# Altium project Brains.PrjPcb
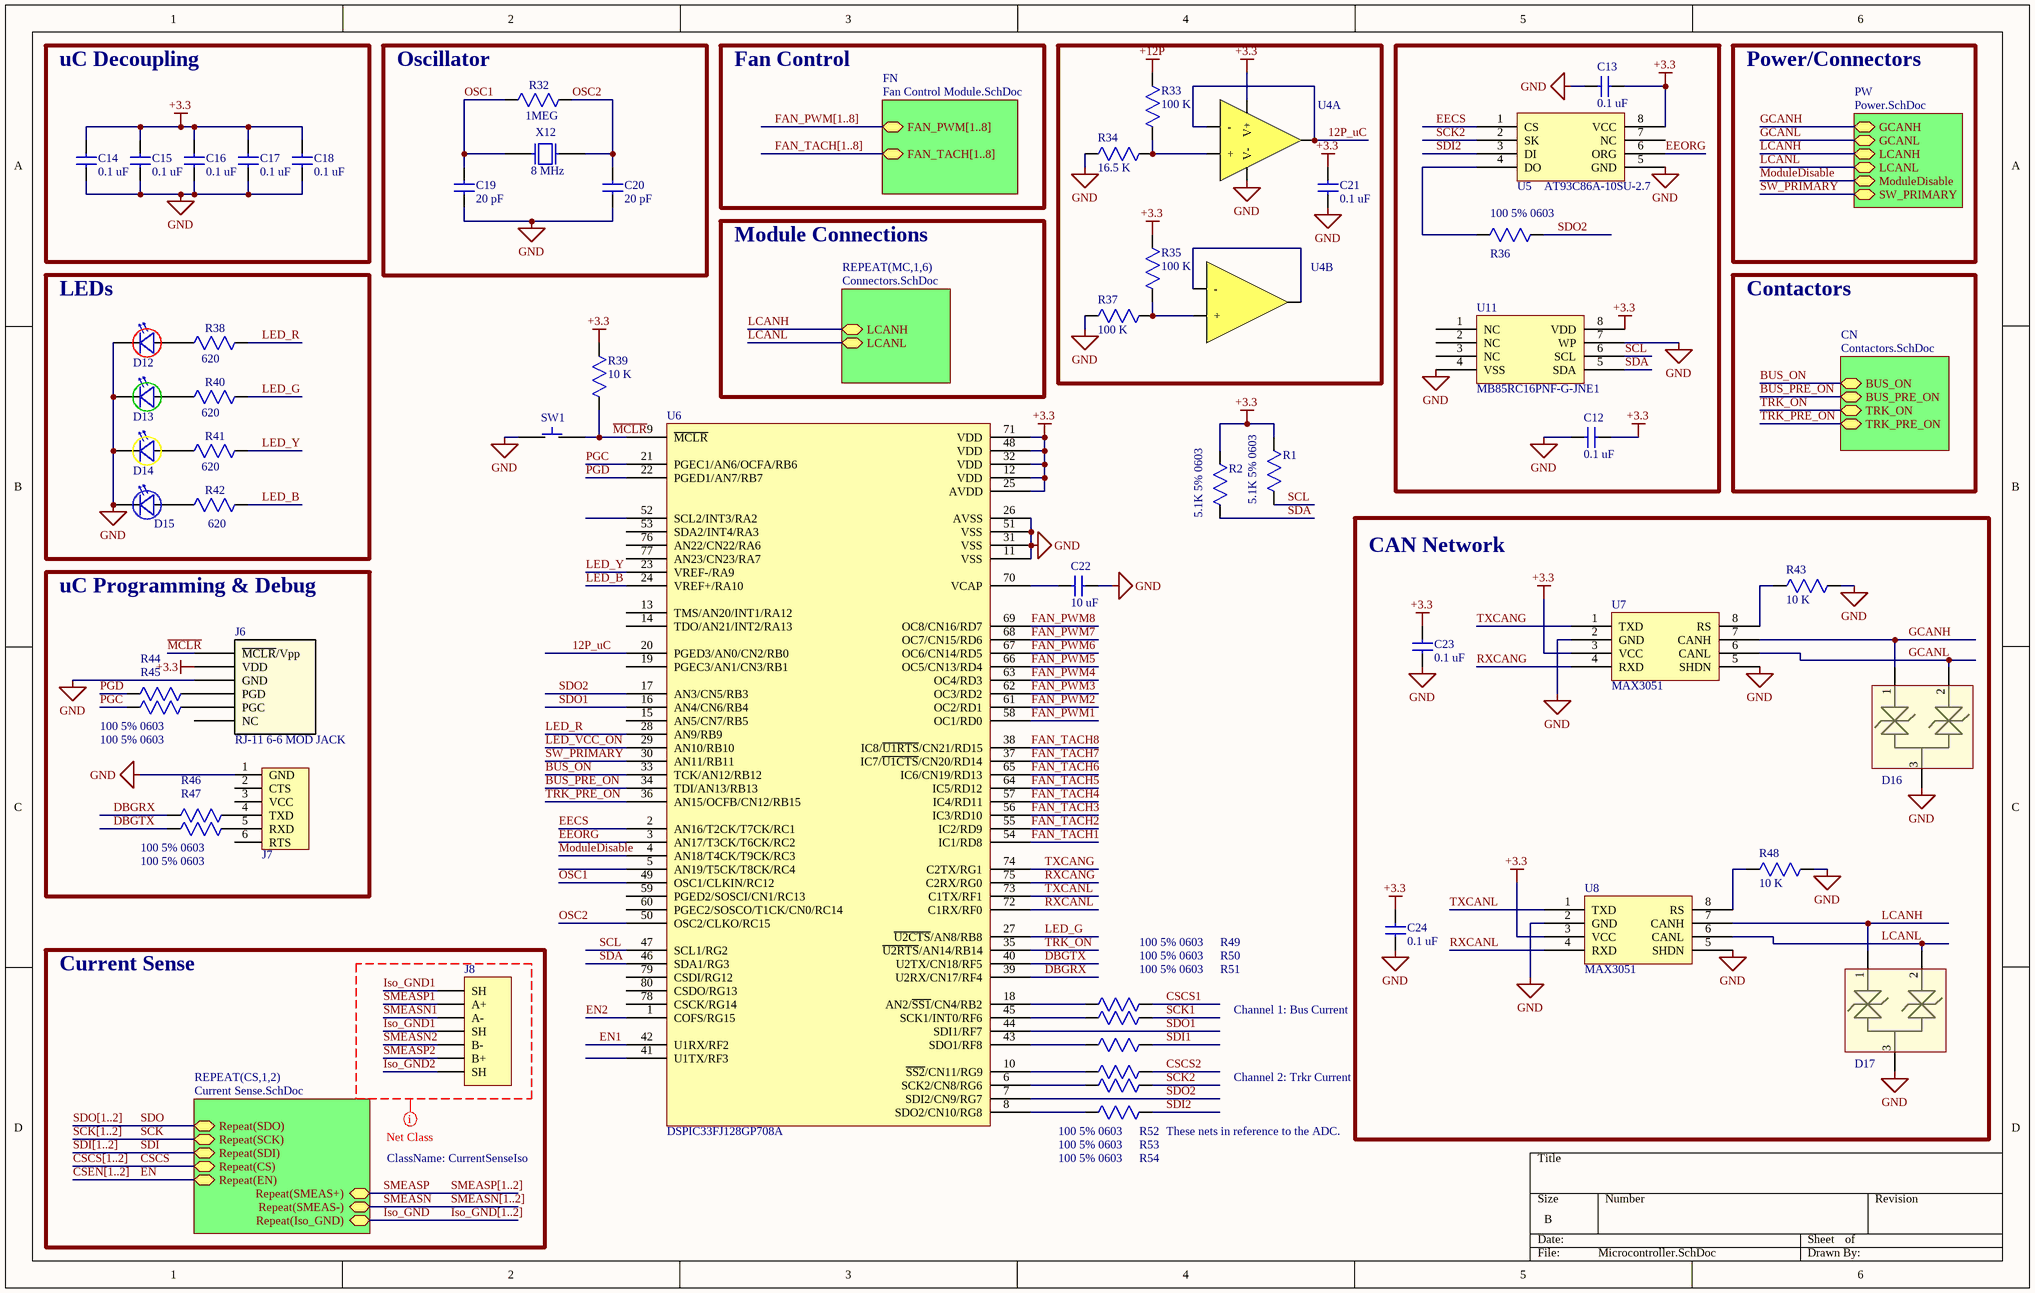
[diagram p0: Microcontroller.SchDoc]
6 sheets, 215 parts. Net scope: hierarchical (ports join the sheet entries above them; power ports are global).
Board file: Brains3.PcbDoc
Sheets:
  Microcontroller.SchDoc
    FN = Fan Control Module.SchDoc
    CS1 = Current Sense.SchDoc
    CS2 = Current Sense.SchDoc
    PW = Power.SchDoc
    CN = Contactors.SchDoc
    MC1 = Connectors.SchDoc
    MC2 = Connectors.SchDoc
    MC3 = Connectors.SchDoc
    MC4 = Connectors.SchDoc
    MC5 = Connectors.SchDoc
    MC6 = Connectors.SchDoc

## Sheet Microcontroller.SchDoc
size B

### Parts
C12  value 0.1 uF  [0603_cap]  (hidden comment: CAP 0603)
C13  value 0.1 uF  [0603_cap]  (hidden comment: CAP 0603)
C14  value 0.1 uF  [0603_cap]  (hidden comment: CAP 0603)
C15  value 0.1 uF  [0603_cap]  (hidden comment: CAP 0603)
C16  value 0.1 uF  [0603_cap]  (hidden comment: CAP 0603)
C17  value 0.1 uF  [0603_cap]  (hidden comment: CAP 0603)
C18  value 0.1 uF  [0603_cap]  (hidden comment: CAP 0603)
C19  value 20 pF  [0805_Capacitor]  (hidden comment: CAP 20PF)
C20  value 20 pF  [0805_Capacitor]  (hidden comment: CAP 20PF)
C21  value 0.1 uF  [0603_cap]  (hidden comment: CAP 0603)
C22  value 10 uF  [0805_Capacitor]  (hidden comment: CAP 10 uF)
C23  value 0.1 uF  [0603_cap]  (hidden comment: CAP 0603)
C24  value 0.1 uF  [0603_cap]  (hidden comment: CAP 0603)
D12  D_LED_0805_RED  [0805P_RED]  (value not drawn)
D13  D_LED_0805_GREEN  [0805P_Green]  (value not drawn)
D14  D_LED_0805_YELLOW  [0805P_YELLOW]  (value not drawn)
D15  D_LED_0805_BLUE  [0805_BLUE]  (value not drawn)
D16  CAN TVS  [SOT-23]  (value not drawn)
D17  CAN TVS  [SOT-23]  (value not drawn)
J6  RJ-11 6-6 MOD JACK  [SS-6466-NF]
J7  IDC Connector  [6PIN_1_.100IN]  (value not drawn)
J8  J_SATA_0471554001  [SATA_67800-8005]  (value not drawn)
R1  value 5.1K 5% 0603  [0603_res]  (hidden comment: RES 0603)
R2  value 5.1K 5% 0603  [0603_res]  (hidden comment: RES 0603)
R32  value 1MEG  [0805_Resistor]  (hidden comment: R_0805_1MEG_1%)
R33  value 100 K  [0603_res]  (hidden comment: RES 0603)
R34  value 16.5 K  [0603_res]  (hidden comment: RES 0603)
R35  value 100 K  [0603_res]  (hidden comment: RES 0603)
R36  value 100 5% 0603  [0603_res]  (hidden comment: RES 0603)
R37  value 100 K  [0603_res]  (hidden comment: RES 0603)
R38  value 620  [0805_Resistor]  (hidden comment: R_0805_620_1%)
R39  value 10 K  [0603_res]  (hidden comment: RES 0603)
R40  value 620  [0805_Resistor]  (hidden comment: R_0805_620_1%)
R41  value 620  [0805_Resistor]  (hidden comment: R_0805_620_1%)
R42  value 620  [0805_Resistor]  (hidden comment: R_0805_620_1%)
R43  value 10 K  [0603_res]  (hidden comment: RES 0603)
R44  value 100 5% 0603  [0603_res]  (hidden comment: RES 0603)
R45  value 100 5% 0603  [0603_res]  (hidden comment: RES 0603)
R46  value 100 5% 0603  [0603_res]  (hidden comment: RES 0603)
R47  value 100 5% 0603  [0603_res]  (hidden comment: RES 0603)
R48  value 10 K  [0603_res]  (hidden comment: RES 0603)
R49  value 100 5% 0603  [0603_res]  (hidden comment: RES 0603)
R50  value 100 5% 0603  [0603_res]  (hidden comment: RES 0603)
R51  value 100 5% 0603  [0603_res]  (hidden comment: RES 0603)
R52  value 100 5% 0603  [0603_res]  (hidden comment: RES 0603)
R53  value 100 5% 0603  [0603_res]  (hidden comment: RES 0603)
R54  value 100 5% 0603  [0603_res]  (hidden comment: RES 0603)
SW1  SW_TACT_SWITCH_6x6  [TACT_SWITCH_6x6]  (value not drawn)
U4  IC OP AMP  [SOIC127P600X175-8N]  (value not drawn)  (parts A,B of 2)
U5  AT93C86A-10SU-2.7  [SOIC127P600X175-8N]
U6  DSPIC33FJ128GP708A  [dspic33-tqfp80]
U7  value MAX3051  [SOIC127P600X175-8N]  (hidden comment: U_MAX3051)
U8  value MAX3051  [SOIC127P600X175-8N]  (hidden comment: U_MAX3051)
U11  Manufacturer PN: MB85RC16PNF-G-JNE1  [SOIC127P600X175-8N]  (hidden comment: U_MB85RC16PNF-G-JNE1)
X12  value 8 MHz  [HC-49]  (hidden comment: HC49)

### Blocks framed on the sheet
uC Decoupling: C14-C18
Oscillator: C19 C20 R32 X12
LEDs: D12-D15 R38 R40-R42
CAN Network: C23 C24 D16 D17 R43 R48 U7 U8
uC Programming & Debug: J6 J7 R44-R47
Current Sense: J8

### Sub-sheets
CN = Contactors.SchDoc: BUS_ON, BUS_PRE_ON, TRK_ON, TRK_PRE_ON
FN = Fan Control Module.SchDoc: FAN_PWM[1..8], FAN_TACH[1..8]
PW = Power.SchDoc: GCANH, GCANL, LCANH, LCANL, ModuleDisable, SW_PRIMARY
REPEAT(CS,1,2) = Current Sense.SchDoc: Repeat(SDO), Repeat(SCK), Repeat(SDI), Repeat(CS), Repeat(SMEAS+), Repeat(SMEAS-), Repeat(EN), Repeat(Iso_GND)
REPEAT(MC,1,6) = Connectors.SchDoc: LCANH, LCANL

### Nets
+3.3: C12.2 C13.2 C14.1 C15.1 C16.1 C17.1 C18.1 C21.1 C23.1 C24.1 J6.2(VDD) R1.1 R2.1 R35.1 R39.1 U4.8(V+) U5.8(VCC) U6.12(VDD) U6.25(AVDD) U6.32(VDD) U6.48(VDD) U6.71(VDD) U7.3(VCC) U8.3(VCC) U11.8(VDD)
+12P: R33.1
GND: C12.1 C13.1 C14.2 C15.2 C16.2 C17.2 C18.2 C19.2 C20.2 C21.2 C22.1 C23.2 C24.2 D12.1(Cathode) D13.1(Cathode) D14.1(Cathode) D15.1(Cathode) D16.3 D17.3 J6.3(GND) J7.1(GND) R34.1 R37.1 R43.1 R48.1 SW1.1 U4.4(V-) U5.5(GND) U6.11(VSS) U6.26(AVSS) U6.31(VSS) U6.51(VSS) U7.2(GND) U7.5(SHDN) U8.2(GND) U8.5(SHDN) U11.4(VSS) U11.7(WP)
12P_uC: U4.1(Vo) U4.2(-) U6.20(PGED3/AN0/CN2/RB0)
BUS_ON: U6.33(TCK/AN12/RB12) ; sheet CN/BUS_ON
BUS_PRE_ON: U6.34(TDI/AN13/RB13) ; sheet CN/BUS_PRE_ON
CSCS: sheet REPEAT(CS,1,2)/Repeat(CS)
CSCS1: R51.1
CSCS2: R54.1
DBGRX: R46.2 U6.39(U2RX/CN17/RF4)
DBGTX: R47.2 U6.40(U2TX/CN18/RF5)
EECS: U5.1(CS) U6.2(AN16/T2CK/T7CK/RC1)
EEORG: U5.6(ORG) U6.3(AN17/T3CK/T6CK/RC2)
EN: sheet REPEAT(CS,1,2)/Repeat(EN)
EN1: U6.42(U1RX/RF2)
EN2: U6.1(COFS/RG15)
FAN_PWM1: U6.58(OC1/RD0)
FAN_PWM2: U6.61(OC2/RD1)
FAN_PWM3: U6.62(OC3/RD2)
FAN_PWM4: U6.63(OC4/RD3)
FAN_PWM5: U6.66(OC5/CN13/RD4)
FAN_PWM6: U6.67(OC6/CN14/RD5)
FAN_PWM7: U6.68(OC7/CN15/RD6)
FAN_PWM8: U6.69(OC8/CN16/RD7)
FAN_TACH1: U6.54(IC1/RD8)
FAN_TACH2: U6.55(IC2/RD9)
FAN_TACH3: U6.56(IC3/RD10)
FAN_TACH4: U6.57(IC4/RD11)
FAN_TACH5: U6.64(IC5/RD12)
FAN_TACH6: U6.65(IC6/CN19/RD13)
FAN_TACH7: U6.37(IC7/~{U1CTS}/CN20/RD14)
FAN_TACH8: U6.38(IC8/~{U1RTS}/CN21/RD15)
GCANH: D16.1 U7.7(CANH) ; sheet PW/GCANH
GCANL: D16.2 U7.6(CANL) ; sheet PW/GCANL
Iso_GND: sheet REPEAT(CS,1,2)/Repeat(Iso_GND)
Iso_GND1: J8.1(SH) J8.4(SH)  [project net Iso_GND]
Iso_GND2: J8.7(SH)  [project net Iso_GND]
LCANH: D17.1 U8.7(CANH) ; sheet PW/LCANH, sheet REPEAT(MC,1,6)/LCANH
LCANL: D17.2 U8.6(CANL) ; sheet PW/LCANL, sheet REPEAT(MC,1,6)/LCANL
LED_B: R42.1 U6.24(VREF+/RA10)
LED_G: R40.1 U6.27(~{U2CTS}/AN8/RB8)
LED_R: R38.1 U6.28(AN9/RB9)
LED_VCC_ON: U6.29(AN10/RB10)
LED_Y: R41.1 U6.23(VREF-/RA9)
~{MCLR}: J6.1(~{MCLR}/Vpp) R39.2 SW1.2 U6.9(~{MCLR})
ModuleDisable: U6.4(AN18/T4CK/T9CK/RC3) ; sheet PW/ModuleDisable
OSC1: C19.1 R32.2 U6.49(OSC1/CLKIN/RC12) X12.2
OSC2: C20.1 R32.1 U6.50(OSC2/CLKO/RC15) X12.1
PGC: R45.2 U6.21(PGEC1/AN6/OCFA/RB6)
PGD: R44.2 U6.22(PGED1/AN7/RB7)
RXCANG: U6.75(C2RX/RG0) U7.4(RXD)
RXCANL: U6.72(C1RX/RF0) U8.4(RXD)
SCK: sheet REPEAT(CS,1,2)/Repeat(SCK)
SCK1: R50.1
SCK2: R53.1 U5.2(SK)
SCL: R1.2 U6.47(SCL1/RG2) U11.6(SCL)
SDA: R2.2 U6.46(SDA1/RG3) U11.5(SDA)
SDI: sheet REPEAT(CS,1,2)/Repeat(SDI)
SDI1: R49.1
SDI2: R52.1 U5.3(DI)
SDO: sheet REPEAT(CS,1,2)/Repeat(SDO)
SDO1: U6.16(AN4/CN6/RB4) U6.44(SDI1/RF7)
SDO2: R36.1 U6.7(SDI2/CN9/RG7) U6.17(AN3/CN5/RB3)
SMEASN: sheet REPEAT(CS,1,2)/Repeat(SMEAS-)
SMEASN1: J8.3(A-)
SMEASN2: J8.5(B-)
SMEASP: sheet REPEAT(CS,1,2)/Repeat(SMEAS+)
SMEASP1: J8.2(A+)
SMEASP2: J8.6(B+)
SW_PRIMARY: U6.30(AN11/RB11) ; sheet PW/SW_PRIMARY
TRK_ON: U6.35(~{U2RTS}/AN14/RB14) ; sheet CN/TRK_ON
TRK_PRE_ON: U6.36(AN15/OCFB/CN12/RB15) ; sheet CN/TRK_PRE_ON
TXCANG: U6.74(C2TX/RG1) U7.1(TXD)
TXCANL: U6.73(C1TX/RF1) U8.1(TXD)
NetC22_2: C22.2 U6.70(VCAP)
NetD12_2: D12.2(Anode) R38.2
NetD13_2: D13.2(Anode) R40.2
NetD14_2: D14.2(Anode) R41.2
NetD15_2: D15.2(Anode) R42.2
NetJ6_4: J6.4(PGD) R44.1
NetJ6_5: J6.5(PGC) R45.1
NetJ7_4: J7.4(TXD) R46.1
NetJ7_5: J7.5(RXD) R47.1
NetR33_2: R33.2 R34.2 U4.3(+)
NetR35_2: R35.2 R37.2 U4.5(+)
NetR36_2: R36.2 U5.4(DO)
NetR43_2: R43.2 U7.8(RS)
NetR48_2: R48.2 U8.8(RS)
NetR49_2: R49.2 U6.43(SDO1/RF8)
NetR50_2: R50.2 U6.45(SCK1/INT0/RF6)
NetR51_2: R51.2 U6.18(AN2/~{SS1}/CN4/RB2)
NetR52_2: R52.2 U6.8(SDO2/CN10/RG8)
NetR53_2: R53.2 U6.6(SCK2/CN8/RG6)
NetR54_2: R54.2 U6.10(~{SS2}/CN11/RG9)
NetU4_6: U4.6(-) U4.7(Vo)

Not connected (* = marked no-connect by the designer): J6 6(NC); J7 2(CTS) 3(VCC) 6(RTS); U5 7(NC); U6 5(AN19/T5CK/T8CK/RC4) 13(TMS/AN20/INT1/RA12) 14(TDO/AN21/INT2/RA13) 15(AN5/CN7/RB5) 19(PGEC3/AN1/CN3/RB1) 41(U1TX/RF3) 52(SCL2/INT3/RA2) 53(SDA2/INT4/RA3) 59(PGED2/SOSCI/CN1/RC13) 60(PGEC2/SOSCO/T1CK/CN0/RC14) 76(AN22/CN22/RA6) 77(AN23/CN23/RA7) 78(CSCK/RG14) 79(CSDI/RG12) 80(CSDO/RG13); U11 1(NC) 2(NC) 3(NC)

### Buses and harness runs
bus CSCS[1..2]
bus CSEN[1..2]
bus FAN_PWM[1..8] = sheet FN/FAN_PWM[1..8]
bus FAN_TACH[1..8] = sheet FN/FAN_TACH[1..8]
bus Iso_GND[1..2]
bus SCK[1..2]
bus SDI[1..2]
bus SDO[1..2]
bus SMEASN[1..2]
bus SMEASP[1..2]

### Layout directives
net class CurrentSenseIso: Iso_GND1, Iso_GND2, SMEASN1, SMEASN2, SMEASP1, SMEASP2

### Notes on the sheet
- Fan Control
- Power/Connectors
- Module Connections
- Contactors
- Channel 1: Bus Current
- Channel 2: Trkr Current
- These nets in reference to the ADC.

### Library data of the parts
C12-C18 C21 C23 C24 = C_0603: CAP CERM 0603; Known Distributors: Digikey; Package: 0603
C19 C20 = C_0805_20PF_100V_5%: CAP CERM 20PF 5% 100V NP0 0805; Manufacturer: AVX; Manufacturer PN: 08051A200JAT2A; SVP Creator: Jonathan Nutzmann; Package: 0805; Known Distributors: Digikey; ComponentLink1Description: Datasheet; ComponentLink1URL: SVN Datasheet URL; Price: 0.231
C22 = C_0805_10uF: CAP CERM 10 uF; Package: 0805; Known Distributors: Digikey; ComponentLink1Description: Datasheet; ComponentLink1URL: SVN Datasheet URL
D12 = D_LED_0805_RED: LED CHIPLED 645NM RED DIFF 0805; SVP Creator: Jonathan Nutzmann; Current: 20mA; Forward Voltage: 1.8; Package: 0805; Known Distributors: Digikey; Value: RED; ComponentLink1Description: Datasheet
D13 = D_LED_0805_GREEN: LED CHIPLED 570NM GREEN 0805 SMD; Manufacturer: Osram Opto Semiconductors Inc; Manufacturer PN: LG R971-KN-1-0-20-R18; SVP Creator: Nate Bolyard; SVP Reviewer 1: Trevtron; Current: 20mA; Forward Voltage: 2.2V; Package: 0805; Known Distributors: Digikey; Value: GREEN; HelpURL: http://umnsvp.dyndns.org/svn/centaurus2/datasheets/common parts/LG_R971.pdf; ComponentLink1URL: http://umnsvp.dyndns.org/svn/centaurus2/datasheets/common parts/LG_R971.pdf; ComponentLink1Description: Datasheet
D14 = D_LED_0805_YELLOW: LED 595NM AMBER DIFF SMD 0805; SVP Creator: Jonathan Nutzmann; Current: 20mA; Forward Voltage: 1.9; Value: YELLOW; Package: 0805; Known Distributors: Digikey; ComponentLink1Description: Datasheet
D15 = D_LED_0805_BLUE: LED 2X1.2MM 470NM BL WTR CLR SMD; SVP Creator: Jonathan Nutzmann; Current: 20mA; Forward Voltage: 3.3; Value: RED; Package: 0805; Known Distributors: Digikey; ComponentLink1Description: Datasheet
D16 D17 = D_NUP2105: IC CAN BUS PROTECTOR DUAL SOT23; Manufacturer: ON Semiconductor; SVP Creator: Thomas Daede; Package: SOT-23; Manufacturer PN: NUP2105; ComponentLink1Description: Datasheet; ComponentLink1URL: SVN Datasheet URL; Price: 0.50
J6 = J_ICD PROG: SCS RJ-11 Jack
J7 = JP_FTDI_USB: FTDI Cable VCC I/O; SVP Creator: Jonathan Nutzmann
J8 = J_SATA_0471554001: CONN SATA HDR 7POS PCB VERT; Manufacturer: Molex; Known Distributors: Digikey; Manufacturer PN: 0471554001
R1 R2 R33-R37 R39 R43-R54 = R_0603: Known Distributors: Digikey; Package: 0603
R32 = R_0805_1MEG_1%: RES 1MEG OHM 1/8W 1% 0805 SMD; Power Rating: .125W; SVP Creator: Brett Paulsen; Package: 0805; Known Distributor: Digikey; ComponentLink1Description: Datasheet
R38 R40-R42 = R_0805_620_1%: RES 620 OHM 1/8W 1% 0805 SMD; Power Rating: .125W; SVP Creator: Jonathan Nutzmann; Package: 0805; Known Distributor: Digikey; ComponentLink1Description: Datasheet
SW1 = SW_TACT_SWITCH_6x6: SWITCH TACT 6MM BLACK 160GF; Manufacturer: Tyco Electronics; Manufacturer PN: FSM4JH; SVP Creator: Nate Bolyard; Known Distributors: Digikey; Package: 6mm x 6mm
U4 = U_MCP6042T-I/SN: IC OPAMP 1UA 1.4V DUAL R-R 8SOIC; Manufacturer: Microchip; SVP Creator: Jonathan Nutzmann; Package: 8-SOIC; Known Distributors: Digikey; Manufacturer PN: MCP6042T-I/SN; ComponentLink1Description: Datasheet; ComponentLink1URL: SVN Datasheet URL; Price: 0.97
U5 = U_AT93C86A-10SU-2.7: IC EEPROM 16KBIT 2MHZ 8SOIC; Manufacturer: Atmel; Package: SOIC-8; Manufacturer PN: AT93C86A-10SU-2.7
U6 = U_DSPIC33FJ128GP708A: IC DSPIC MCU/DSP 128K 80-TQFP; Manufacturer: Microchip; SVP Creator: Jonathan Nutzmann; Package: 80-TQFP; Known Distributors: Digikey; ComponentLink1Description: Datasheet; ComponentLink1URL: SVN Datasheet URL; Manufacturer PN: DSPIC33FJ128GP708A
U7 U8 = U_MAX3051: IC TXRX CAN 1MBPS 8-SOIC 3.3V; Manufacturer: Maxim; Manufacturer PN: MAX3051ESA+; SVP Creator: Jonathan Nutzmann; Package: SOIC-8; Known Distributors: DigiKey; ComponentLink1Description: Datasheet
U11 = U_MB85RC16PNF-G-JNE1: IC FRAM 16KBIT 1MHZ 8SOP; Manufacturer: Fujitsu Semiconductor America Inc; Package: SOIC-8; Known Distributors: DigiKey; ComponentLink1Description: Datasheet
X12 = X_HC49: CRYSTAL 8.00 MHZ 20PF 49US; Manufacturer: ECS; Manufacturer PN: ECS-80-20-4X; SVP Creator: Jonathan Nutzmann; Load Capacitance: 20pF; Known Distributor: Digikey; Package: HC49/US; ComponentLink1Description: Datasheet

## Sheet Fan Control Module.SchDoc
size A
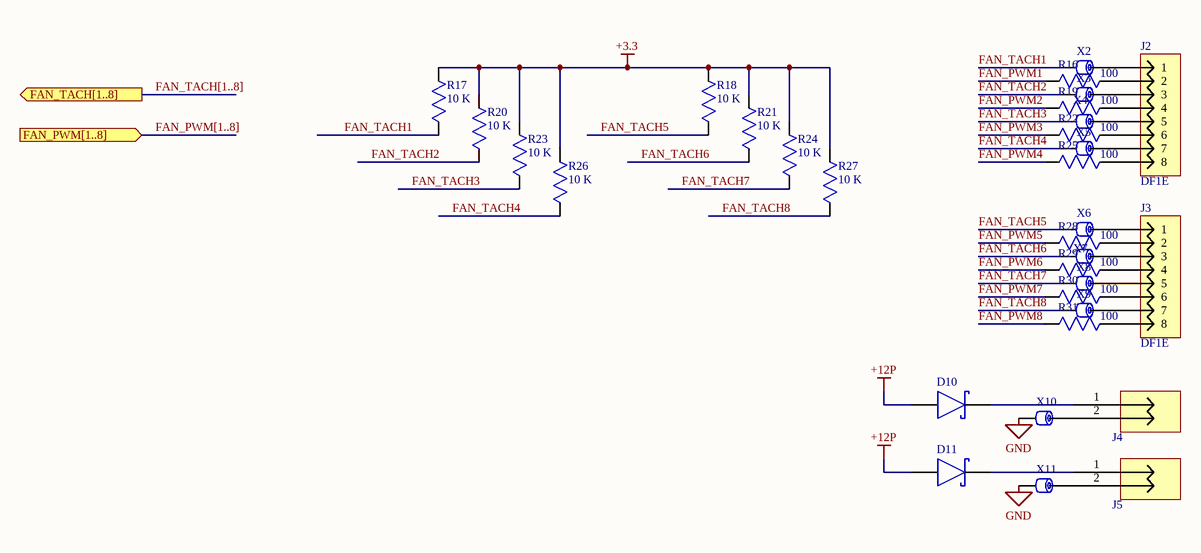
[diagram p1: Fan Control Module.SchDoc]

### Parts
D10  STPS20L15G-TR  [D2PAK-D]  (value not drawn)
D11  STPS20L15G-TR  [D2PAK-D]  (value not drawn)
J2  value DF1E  [DF1EC-8P-2.5DSA]  (hidden comment: DF1E 5-pin Male Header)
J3  value DF1E  [DF1EC-8P-2.5DSA]  (hidden comment: DF1E 5-pin Male Header)
J4  J_PHOENIX_2M_5.08  [PHX2UP]  (value not drawn)
J5  J_PHOENIX_2M_5.08  [PHX2UP]  (value not drawn)
R16  value 100  [0603_res]  (hidden comment: RES 0603)
R17  value 10 K  [0603_res]  (hidden comment: RES 0603)
R18  value 10 K  [0603_res]  (hidden comment: RES 0603)
R19  value 100  [0603_res]  (hidden comment: RES 0603)
R20  value 10 K  [0603_res]  (hidden comment: RES 0603)
R21  value 10 K  [0603_res]  (hidden comment: RES 0603)
R22  value 100  [0603_res]  (hidden comment: RES 0603)
R23  value 10 K  [0603_res]  (hidden comment: RES 0603)
R24  value 10 K  [0603_res]  (hidden comment: RES 0603)
R25  value 100  [0603_res]  (hidden comment: RES 0603)
R26  value 10 K  [0603_res]  (hidden comment: RES 0603)
R27  value 10 K  [0603_res]  (hidden comment: RES 0603)
R28  value 100  [0603_res]  (hidden comment: RES 0603)
R29  value 100  [0603_res]  (hidden comment: RES 0603)
R30  value 100  [0603_res]  (hidden comment: RES 0603)
R31  value 100  [0603_res]  (hidden comment: RES 0603)
X2  0603  [0603_res]  (value not drawn)
X3  0603  [0603_res]  (value not drawn)
X4  0603  [0603_res]  (value not drawn)
X5  0603  [0603_res]  (value not drawn)
X6  0603  [0603_res]  (value not drawn)
X7  0603  [0603_res]  (value not drawn)
X8  0603  [0603_res]  (value not drawn)
X9  0603  [0603_res]  (value not drawn)
X10  Ferrite Bead  [28F0181-1SR-10]  (value not drawn)
X11  Ferrite Bead  [28F0181-1SR-10]  (value not drawn)

### Ports
FAN_PWM[1..8] (in), FAN_TACH[1..8] (out)

### Nets
+3.3: R17.1 R18.1 R20.1 R21.1 R23.1 R24.1 R26.1 R27.1
+12P: D10.A D11.A
GND: X10.1 X11.1
FAN_PWM1: R16.2
FAN_PWM2: R19.2
FAN_PWM3: R22.2
FAN_PWM4: R25.2
FAN_PWM5: R28.2
FAN_PWM6: R29.2
FAN_PWM7: R30.2
FAN_PWM8: R31.2
FAN_TACH1: R17.2 X2.1
FAN_TACH2: R20.2 X3.1
FAN_TACH3: R23.2 X4.1
FAN_TACH4: R26.2 X5.1
FAN_TACH5: R18.2 X6.1
FAN_TACH6: R21.2 X7.1
FAN_TACH7: R24.2 X8.1
FAN_TACH8: R27.2 X9.1
NetD10_K: D10.K J4.1
NetD11_K: D11.K J5.1
NetJ2_1: J2.1 X2.2
NetJ2_2: J2.2 R16.1
NetJ2_3: J2.3 X3.2
NetJ2_4: J2.4 R19.1
NetJ2_5: J2.5 X4.2
NetJ2_6: J2.6 R22.1
NetJ2_7: J2.7 X5.2
NetJ2_8: J2.8 R25.1
NetJ3_1: J3.1 X6.2
NetJ3_2: J3.2 R28.1
NetJ3_3: J3.3 X7.2
NetJ3_4: J3.4 R29.1
NetJ3_5: J3.5 X8.2
NetJ3_6: J3.6 R30.1
NetJ3_7: J3.7 X9.2
NetJ3_8: J3.8 R31.1
NetJ4_2: J4.2 X10.2
NetJ5_2: J5.2 X11.2

### Buses and harness runs
bus FAN_PWM[1..8] = port FAN_PWM[1..8]
bus FAN_TACH[1..8] = port FAN_TACH[1..8]

### Library data of the parts
D10 D11 = D_Schottky_20A_15V_D2PAK: DIODE SCHOTTKY 20A 15V D2PAK; Manufacturer: STMicro; SVP Creator: Jonathan Nutzmann; Known Distributors: Digi-Key; Manufacturer PN: STPS20L15G-TR; Price: 3.49; ComponentLink1Description: Datasheet
J2 J3 = DF1E_8_S: 9-pin Hirose; Manufacturer: Hirose Electric Co Ltd; Manufacturer PN: DF1EC-8P-2.5DSA(05); SVP Creator: Adam Shea; Package: DF1EC-8; Known Distributors: Digikey; HelpURL: http://umnsvp.dyndns.org/svn/centaurus2/datasheets/common%20parts/DF1E.pdf; ComponentLink1URL: http://umnsvp.dyndns.org/svn/centaurus2/datasheets/common%20parts/DF1E.pdf; ComponentLink1Description: Datasheet
J4 J5 = J_PHOENIX_2M_5.08: 2 Pin From Motor
R16-R31 = R_0603: Known Distributors: Digikey; Package: 0603
X2-X9 = X_0603_FERRITE: FERRITE 0603; Known Distributors: Digikey; Package: 0603
X10 X11 = X_FERRITE_10A_3318: FERRITE 10A 115 OHMS SMD; Manufacturer: Laird-Signal Integrity Products; Package: 3318; Known Distributors: Digikey; Manufacturer PN: 28F0181-1SR-10; Current Rating: 10A

## Sheet Current Sense.SchDoc
size B
Used 2 times, as channels CS1, CS2. Parts and nets are listed once, with the designators drawn on the sheet.
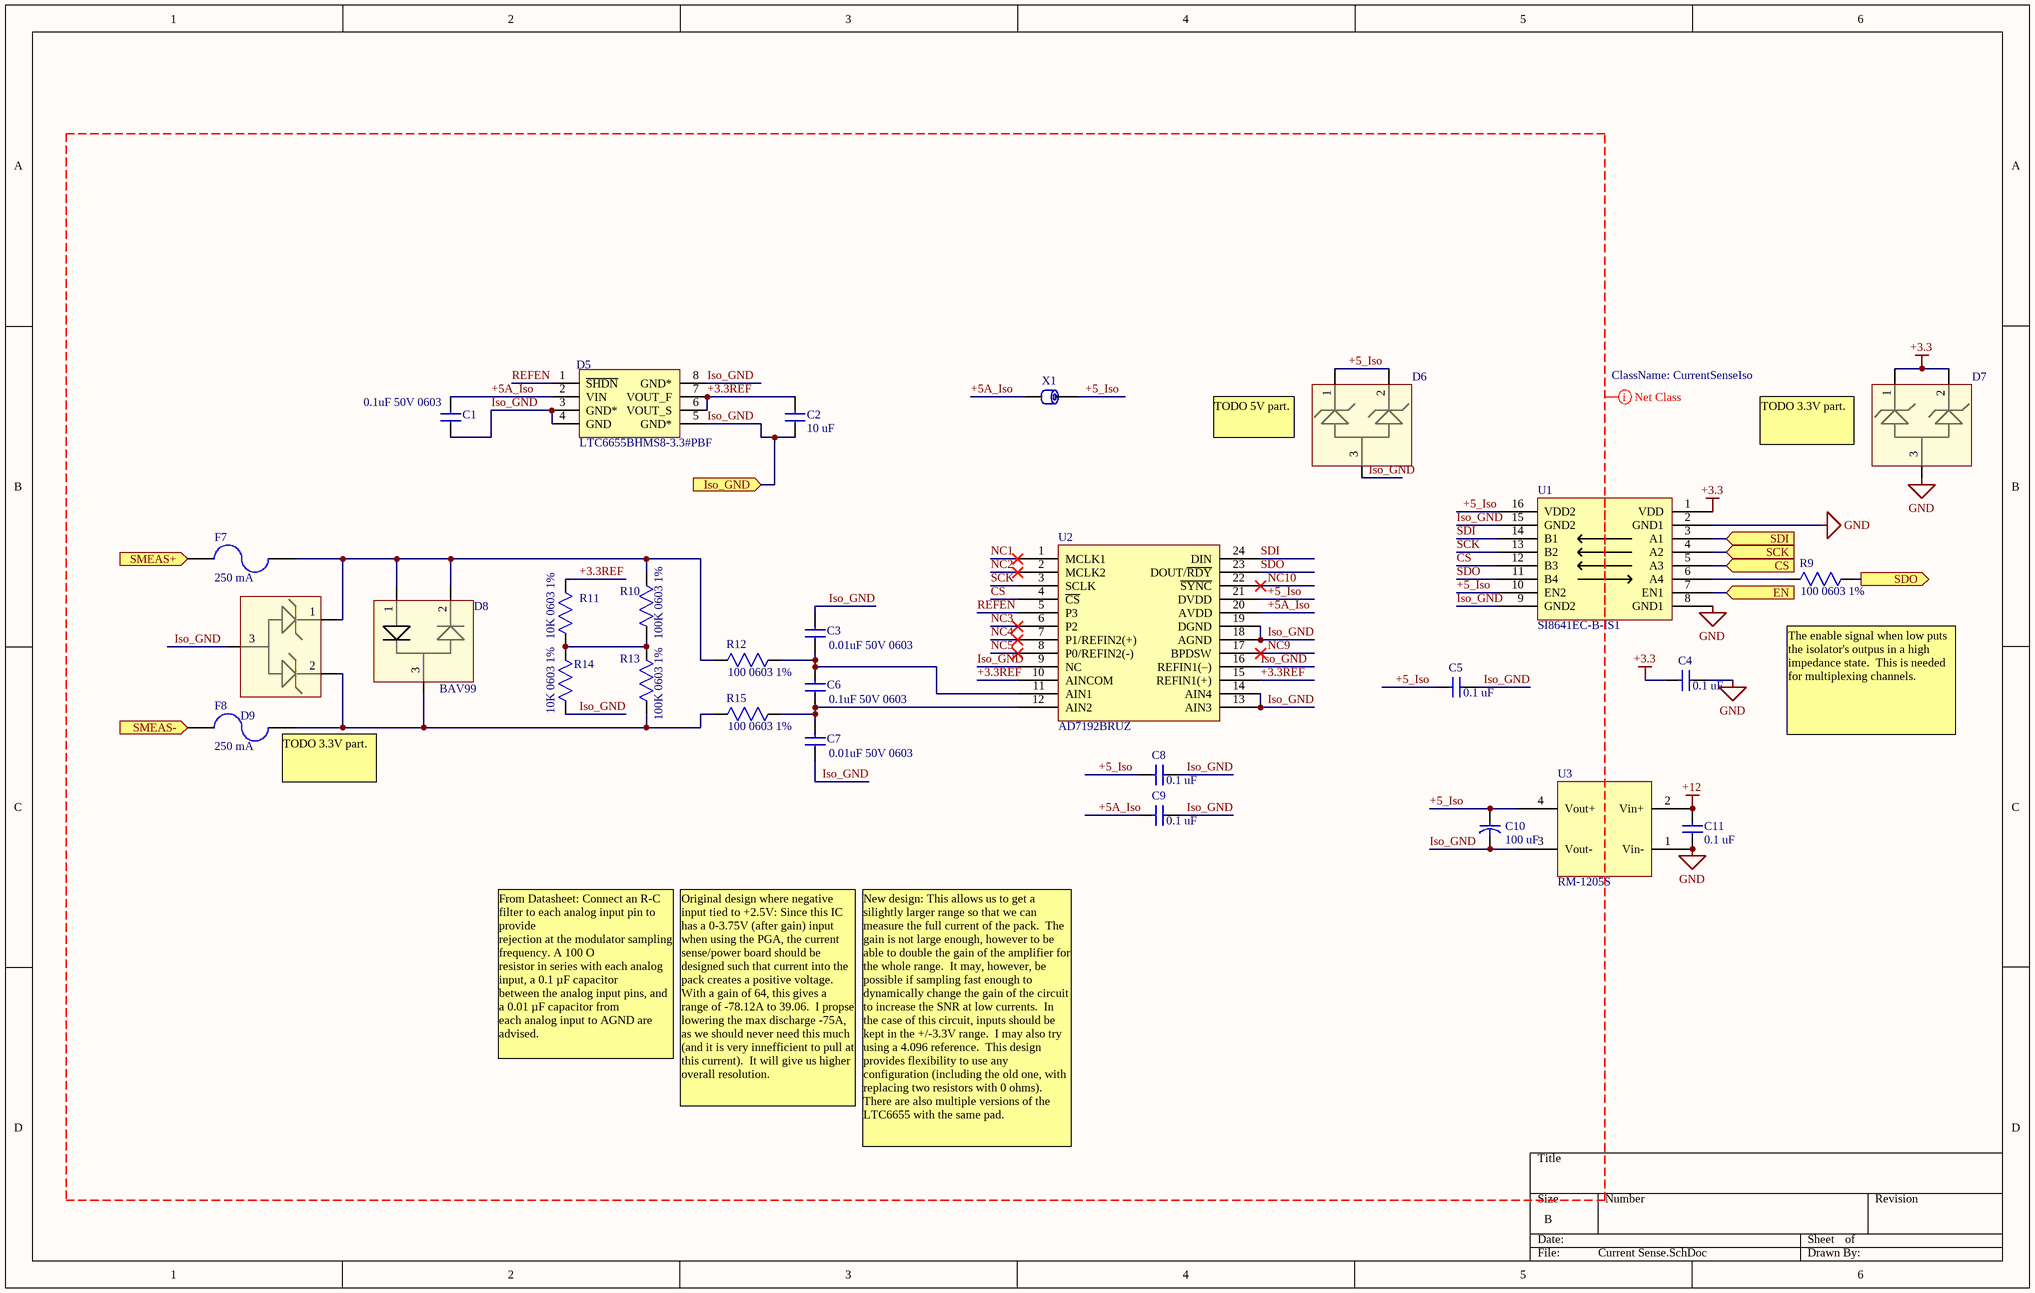
[diagram p2: Current Sense.SchDoc]

### Parts
C1  value 0.1uF 50V 0603  [0603_cap]  (hidden comment: CAP 0603)
C2  value 10 uF  [0805_Capacitor]  (hidden comment: CAP 10 uF)
C3  value 0.01uF 50V 0603  [0603_cap]  (hidden comment: CAP 0603)
C4  value 0.1 uF  [0603_cap]  (hidden comment: CAP 0603)
C5  value 0.1 uF  [0603_cap]  (hidden comment: CAP 0603)
C6  value 0.1uF 50V 0603  [0603_cap]  (hidden comment: CAP 0603)
C7  value 0.01uF 50V 0603  [0603_cap]  (hidden comment: CAP 0603)
C8  value 0.1 uF  [0603_cap]  (hidden comment: CAP 0603)
C9  value 0.1 uF  [0603_cap]  (hidden comment: CAP 0603)
C10  value 100 uF  [EEE-FP1V101AP]  (hidden comment: EEE-FP1V101AP)
C11  value 0.1 uF  [0603_cap]  (hidden comment: CAP 0603)
D5  Manufacturer PN: LTC6655BHMS8-3.3#PBF  [TSOP65P490X110-8N]  (hidden comment: D_LTC6655BHMS8-3.3#PBF)
D6  MMBZ6V8AL,215  [SOT-23]  (value not drawn)
D7  MMBZ6V8AL,215  [SOT-23]  (value not drawn)
D8  BAV99  [SOT-23]
D9  MMBZ6V8AL,215  [SOT-23]  (value not drawn)
F7  250 mA  [1206_RESISTOR]
F8  250 mA  [1206_RESISTOR]
R9  value 100 0603 1%  [0603_res]  (hidden comment: RES 0603)
R10  value 100K 0603 1%  [0603_res]  (hidden comment: RES 0603)
R11  value 10K 0603 1%  [0603_res]  (hidden comment: RES 0603)
R12  value 100 0603 1%  [0603_res]  (hidden comment: RES 0603)
R13  value 100K 0603 1%  [0603_res]  (hidden comment: RES 0603)
R14  value 10K 0603 1%  [0603_res]  (hidden comment: RES 0603)
R15  value 100 0603 1%  [0603_res]  (hidden comment: RES 0603)
U1  Manufacturer PN: SI8641EC-B-IS1  [SOIC16_SI8641]  (hidden comment: U_SI6841EC-B)
U2  Manufacturer PN: AD7192BRUZ  [TSOP65P640X120-24N]  (hidden comment: U_AD7192)
U3  Manufacturer PN: RM-1205S  [SIP4]  (hidden comment: U_RM-1205S)
X1  Ferrite Bead  [0603_res]  (value not drawn)

### Ports
CS, EN, Iso_GND, SCK, SDI, SDO, SMEAS+, SMEAS-

### Nets
+3.3: C4.2 D7.1 D7.2 U1.1(VDD)
+12: C11.1 U3.2(Vin+)
GND: C4.1 C11.2 D7.3 U1.2(GND1) U1.8(GND1) U3.1(Vin-)
+3.3REF: C2.1 D5.6(VOUT_S) D5.7(VOUT_F) R11.2 U2.10(AINCOM) U2.15(REFIN1(+))
+5_Iso: C5.2 C8.2 C10.1 D6.1 D6.2 U1.10(EN2) U1.16(VDD2) U2.21(DVDD) U3.4(Vout+) X1.2
+5A_Iso: C1.1 C9.2 D5.2(VIN) U2.20(AVDD) X1.1
CS: U1.5(A3) ; port CS
CS: U1.12(B3) U2.4(~{CS})  [a separate net that carries the same name]
EN: U1.7(EN1) ; port EN
Iso_GND: C1.2 C2.2 C3.1 C5.1 C7.2 C8.1 C9.1 C10.2 D5.3(GND*) D5.4(GND) D5.5(GND*) D5.8(GND*) D6.3 D9.3 R14.1 U1.9(GND2) U1.15(GND2) U2.9(NC) U2.13(AIN3) U2.14(AIN4) U2.16(REFIN1(–)) U2.18(AGND) U2.19(DGND) U3.3(Vout-) ; port Iso_GND
NC1: U2.1(MCLK1)
NC2: U2.2(MCLK2)
NC3: U2.6(P2)
NC4: U2.7(P1/REFIN2(+))
NC5: U2.8(P0/REFIN2(-))
NC9: U2.17(BPDSW)
NC10: U2.22(~{SYNC})
REFEN: D5.1(~{SHDN}) U2.5(P3)
SCK: U1.4(A2) ; port SCK
SCK: U1.13(B2) U2.3(SCLK)  [a separate net that carries the same name]
SDI: U1.3(A1) ; port SDI
SDI: U1.14(B1) U2.24(DIN)  [a separate net that carries the same name]
SDO: U1.11(B4) U2.23(DOUT/~{RDY})
SDO: R9.1 ; port SDO  [a separate net that carries the same name]
SMEAS+: F7.1 ; port SMEAS+
SMEAS-: F8.1 ; port SMEAS-
NetC3_2: C3.2 C6.1 R12.1 U2.11(AIN1)
NetC6_2: C6.2 C7.1 R15.1 U2.12(AIN2)
NetD8_1: D8.1 D8.2 D9.1 F7.2 R10.2 R12.2
NetD8_3: D8.3 D9.2 F8.2 R13.1 R15.2
NetR9_2: R9.2 U1.6(A4)
NetR10_1: R10.1 R11.1 R13.2 R14.2

### Channels
CS1: designators end in _1; ports CS=CSCS1 EN=EN1 Iso_GND=Iso_GND SCK=SCK1 SDI=SDI1 SDO=SDO1 SMEAS+=SMEASP1 SMEAS-=SMEASN1
CS2: designators end in _2; ports CS=CSCS2 EN=EN2 Iso_GND=Iso_GND SCK=SCK2 SDI=SDI2 SDO=SDO2 SMEAS+=SMEASP2 SMEAS-=SMEASN2

### Layout directives
net class CurrentSenseIso: +3.3REF, +5_Iso, +5A_Iso, CS, Iso_GND, NC1, NC2, NC3, NC4, NC5, NC9, NC10, REFEN, SCK, SDI, SDO

### Notes on the sheet
- (near D6) TODO 5V part.
- (near D7) TODO 3.3V part.
- (near F8) TODO 3.3V part.
- (near R9) The enable signal when low puts the isolator's outpus in a high impedance state.  This is needed for multiplexing channels.
- From Datasheet: Connect an R-C filter to each analog input pin to provide
  rejection at the modulator sampling frequency. A 100 O
  resistor in series with each analog input, a 0.1 µF capacitor
  between the analog input pins, and a 0.01 µF capacitor from
  each analog input to AGND are advised.
- Original design where negative input tied to +2.5V: Since this IC has a 0-3.75V (after gain) input when using the PGA, the current sense/power board should be designed such that current into the pack creates a positive voltage.  With a gain of 64, this gives a range of -78.12A to 39.06.  I propse lowering the max discharge -75A, as we should never need this much (and it is very innefficient to pull at this current).  It will give us higher overall resolution.
- New design: This allows us to get a silightly larger range so that we can measure the full current of the pack.  The gain is not large enough, however to be able to double the gain of the amplifier for the whole range.  It may, however, be possible if sampling fast enough to dynamically change the gain of the circuit to increase the SNR at low currents.  In the case of this circuit, inputs should be kept in the +/-3.3V range.  I may also try using a 4.096 reference.  This design provides flexibility to use any configuration (including the old one, with replacing two resistors with 0 ohms).  There are also multiple versions of the LTC6655 with the same pad.

### Library data of the parts
C1 C3-C9 C11 = C_0603: CAP CERM 0603; Known Distributors: Digikey; Package: 0603
C2 = C_0805_10uF: CAP CERM 10 uF; SVP Creator: Matt Rogge; Package: 0805; Known Distributors: Digikey; ComponentLink1Description: Datasheet; ComponentLink1URL: SVN Datasheet URL
C10 = C_POLY_100uF_35V: CAP ALUM 100UF 35V 20% SMD; Manufacturer: Panasonic; SVP Creator: Jonathan Nutzmann; ESR: 80mOhms; Package: Radial, Can - SMD; Known Distributors: Digikey; Manufacturer PN: EEE-FP1V101AP; ComponentLink1Description: Datasheet; ComponentLink1URL: http://search.digikey.com/scripts/DkSearch/dksus.dll?Detail&name=PCE4442CT-ND; Price: 1.03; Tolerance: 20%
D5 = D_LTC6655BHMS8-3.3#PBF: IC VREF SERIES PREC 3.3V 8-MSOP; Manufacturer: Linear Technology; SVP Creator: Jonathan Nutzmann; Known Distributors: Digi-Key; ComponentLink1Description: Datasheet
D6 D7 D9 = D_MMBZ6V8AL,215: DIODE ESD PROT DBL 4.5V SOT23; Manufacturer: NXP; SVP Creator: Jonathan Nutzmann; Package: SOT-23; Manufacturer PN: MMBZ6V8AL,215; ComponentLink1Description: Datasheet; ComponentLink1URL: SVN Datasheet URL; Price: .45
D8 = D_BAV99: DIODE ULTRAFAST HI COND SOT-23; Manufacturer: Fairchild; SVP Creator: Jonathan Nutzmann; Package: SOT-23; Manufacturer PN: BAV99
F7 F8 = F_250mA_1206: FUSE 250 mA 1206; SVN Creator: Jonathan Nutzmann; SVN Reviewer 2: *; Package: 1206
R9-R15 = R_0603: Known Distributors: Digikey; Package: 0603
U1 = U_SI6841EC-B: IC ISOLATOR 4CH 3.75V 16-SOIC; Manufacturer: Silicon Labs
U2 = U_AD7192: IC ADC 24BIT 2CH W/PGA 24-TSSOP; Manufacturer: Analog Devices
U3 = U_RM-1205S: CONV DC/DC 0.25W SGL 5V OUT SIP4; Manufacturer: Recom Power Inc
X1 = X_FERRITE_0805: FERRITE CHIP BEAD 600 OHM SMD; Manufacturer: TDK Corp; Manufacturer PN: MPZ2012S601A; SVP Creator: Brett Paulsen; Current Rating: 2A; Package: 0805; Known Distributors: Digikey

## Sheet Power.SchDoc
size B
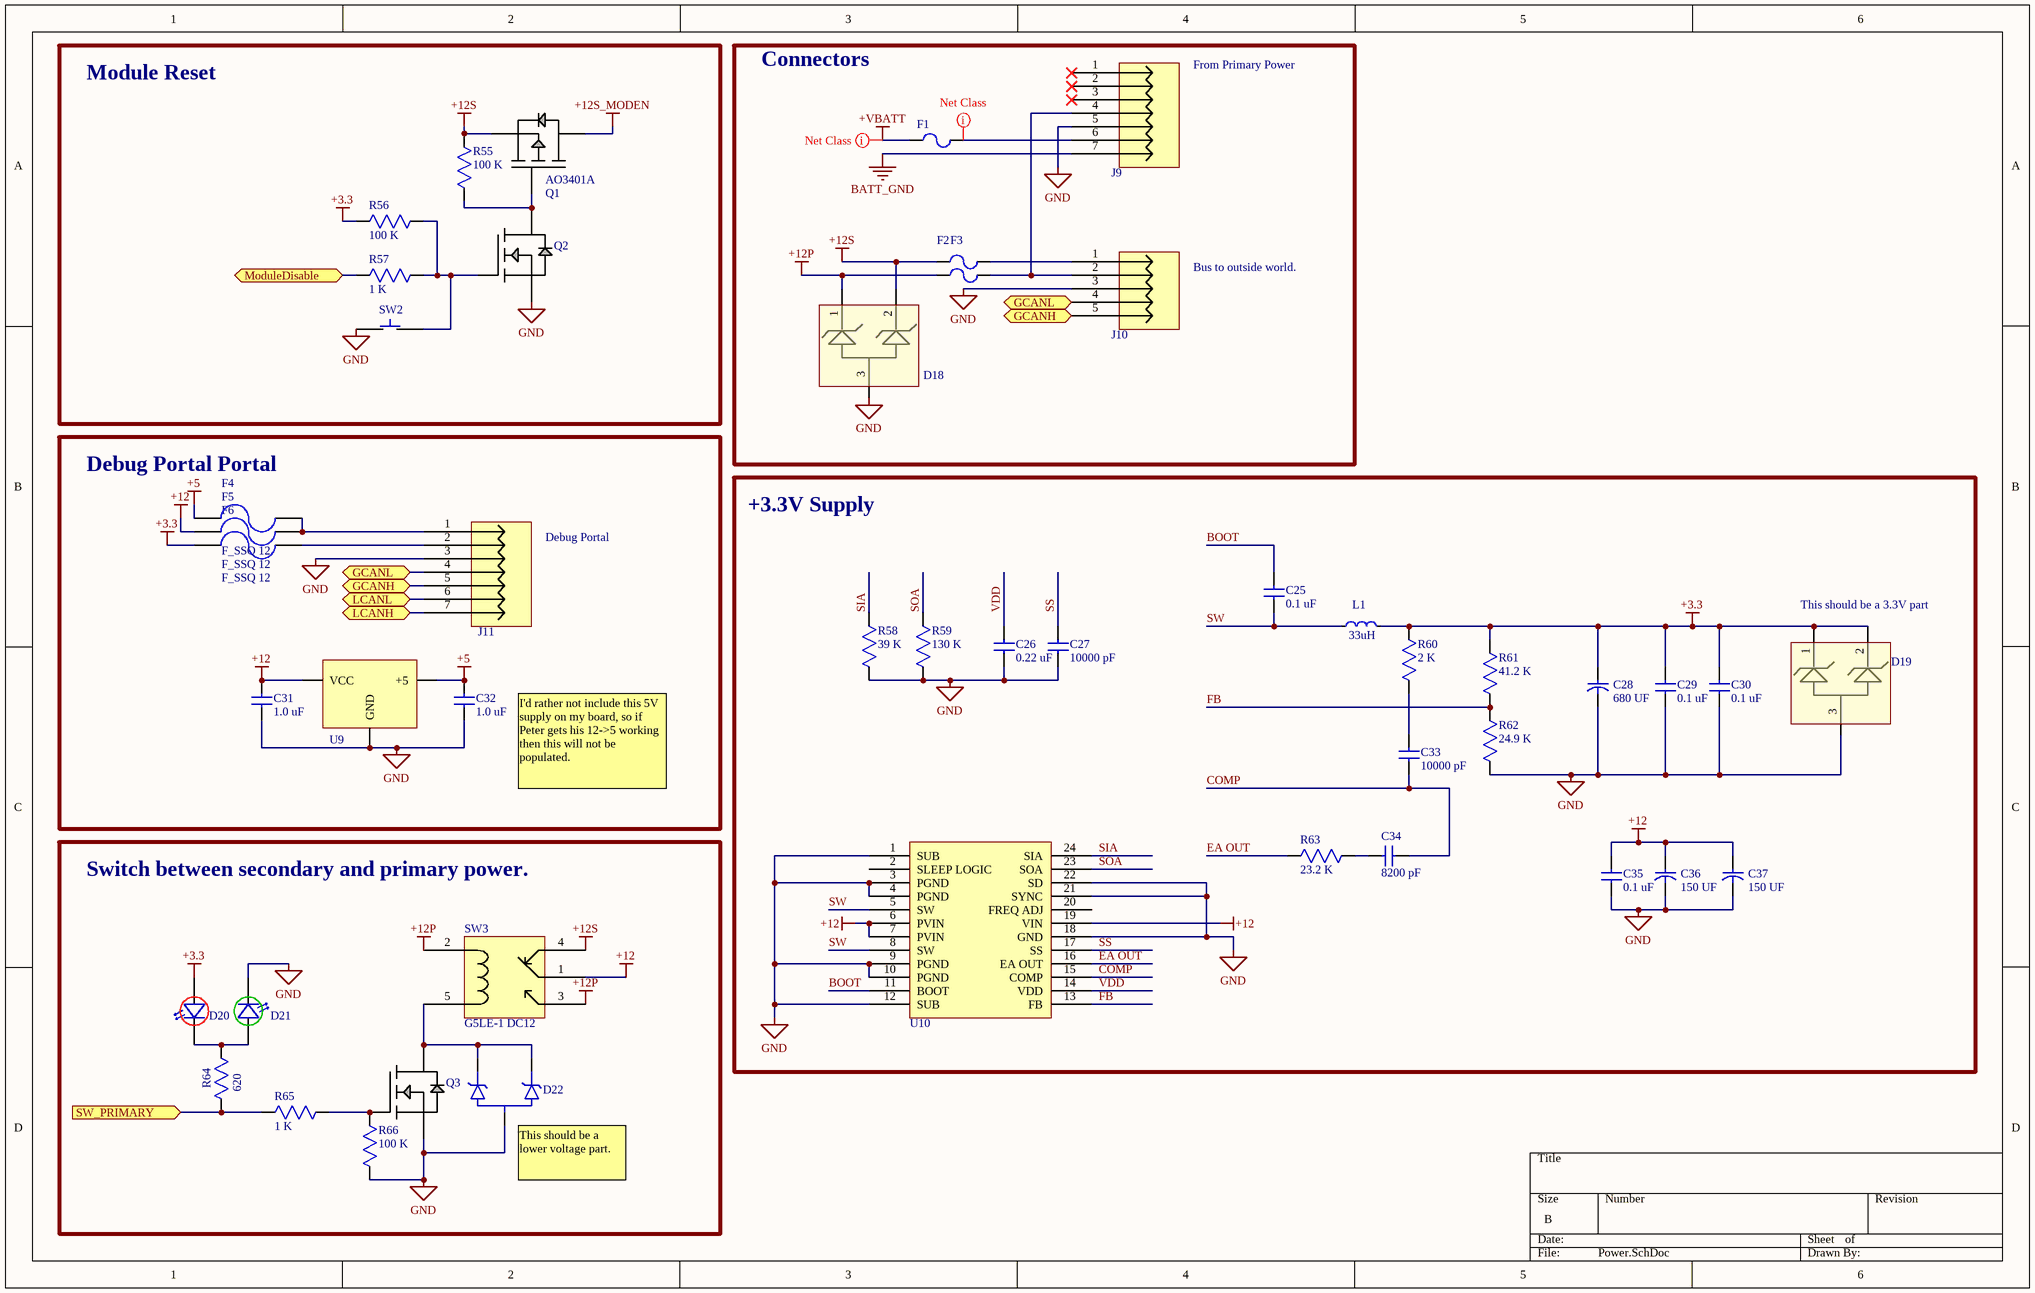
[diagram p3: Power.SchDoc]

### Parts
C25  value 0.1 uF  [0603_cap]  (hidden comment: CAP 0603)
C26  value 0.22 uF  [0603_cap]  (hidden comment: CAP 0603)
C27  value 10000 pF  [0603_cap]  (hidden comment: CAP 0603)
C28  value 680 UF  [CAP_NICHICON_R7]  (hidden comment: CAP POLY 680UF)
C29  value 0.1 uF  [0603_cap]  (hidden comment: CAP 0603)
C30  value 0.1 uF  [0603_cap]  (hidden comment: CAP 0603)
C31  value 1.0 uF  [0805_Capacitor]  (hidden comment: CAP 1uF)
C32  value 1.0 uF  [0805_Capacitor]  (hidden comment: CAP 1uF)
C33  value 10000 pF  [0603_cap]  (hidden comment: CAP 0603)
C34  value 8200 pF  [0603_cap]  (hidden comment: CAP 0603)
C35  value 0.1 uF  [0603_cap]  (hidden comment: CAP 0603)
C36  value 150 UF  [CAP_NICHICON_R7]  (hidden comment: CAP POLY 150UF)
C37  value 150 UF  [CAP_NICHICON_R7]  (hidden comment: CAP POLY 150UF)
D18  SM15.TCT  [SOT-23]  (value not drawn)
D19  MMBZ6V8AL,215  [SOT-23]  (value not drawn)
D20  D_LED_0805_RED  [0805P_RED]  (value not drawn)
D21  D_LED_0805_GREEN  [0805P_Green]  (value not drawn)
D22  D_AZ23C36-TP  [SOT-23]  (value not drawn)
F1  F_3101.0040  [FPG4 Fuseholder]  (value not drawn)
F2  F_3101.0040  [FPG4 Fuseholder]  (value not drawn)
F3  F_3101.0040  [FPG4 Fuseholder]  (value not drawn)
F4  F_SSQ 12  [2410]
F5  F_SSQ 12  [2410]
F6  F_SSQ 12  [2410]
J9  J_PHOENIX_7M_5.08  [PHONEIX_7_5.08]  (value not drawn)
J10  J_PHOENIX_5M_3.5  [1843635]  (value not drawn)
J11  (no value)  [1843651]
L1  value 33uH  [L_SRR1210]  (hidden comment: L_33uH_20%)
Q1  Manufacturer PN: AO3401A  [SOT-23]  (hidden comment: Q_AO3401A)
Q2  RK7002BT116  [SOT-23]  (value not drawn)
Q3  2SK3541T2L  [SOT-23]  (value not drawn)
R55  value 100 K  [0603_res]  (hidden comment: RES 0603)
R56  value 100 K  [0603_res]  (hidden comment: RES 0603)
R57  value 1 K  [0603_res]  (hidden comment: RES 0603)
R58  value 39 K  [0603_res]  (hidden comment: RES 0603)
R59  value 130 K  [0603_res]  (hidden comment: RES 0603)
R60  value 2 K  [0603_res]  (hidden comment: RES 0603)
R61  value 41.2 K  [0603_res]  (hidden comment: RES 0603)
R62  value 24.9 K  [0603_res]  (hidden comment: RES 0603)
R63  value 23.2 K  [0603_res]  (hidden comment: RES 0603)
R64  value 620  [0805_Resistor]  (hidden comment: R_0805_620_1%)
R65  value 1 K  [0603_res]  (hidden comment: RES 0603)
R66  value 100 K  [0603_res]  (hidden comment: RES 0603)
SW2  SW_TACT_SWITCH_6x6  [TACT_SWITCH_6x6]  (value not drawn)
SW3  SW_G5LE-1 DC12  [G5LE-1 DC12]  (value not drawn)
U9  MC7805BDTG  [DPAK]  (value not drawn)
U10  LM2650 DC/DC Converter  [SOIC127P1030X265-24N]  (value not drawn)

### Blocks framed on the sheet
Module Reset: Q1 Q2 R55-R57 SW2
Connectors: D18 F1-F3 J9 J10
Debug Portal Portal: C31 C32 F4-F6 J11 U9
+3.3V Supply: C25-C30 C33-C37 D19 L1 R58-R63 U10
Switch between secondary and primary power.: D20-D22 Q3 R64-R66 SW3

### Ports
GCANH, GCANL, LCANH, LCANL, ModuleDisable, SW_PRIMARY

### Nets
+3.3: C28.1 C29.1 C30.1 D19.1 D19.2 D20.2(Anode) F6.1 L1.2 R56.2 R60.1 R61.2
+5: C32.1 F4.1 U9.2(+5)
+12: C31.1 C35.1 C36.1 C37.1 F5.1 SW3.1 U9.3(VCC) U10.6(PVIN) U10.7(PVIN) U10.19(VIN)
+12P: D18.1 F3.1 SW3.2(+) SW3.3
+12S: D18.2 F2.1 Q1.2(SOURCE) R55.2 SW3.4
+12S_MODEN: Q1.3(DRAIN)
+VBATT: F1.1
BATT_GND: J9.7
GND: C26.2 C27.2 C28.2 C29.2 C30.2 C31.2 C32.2 C35.2 C36.2 C37.2 D18.3 D19.3 D21.1(Cathode) D22.3(ANODE) J9.5 J10.3 J11.3 Q2.2(SOURCE) Q3.2(SOURCE) R58.2 R59.2 R62.1 R66.1 SW2.1 U9.1(GND) U10.1(SUB) U10.3(PGND) U10.4(PGND) U10.9(PGND) U10.10(PGND) U10.12(SUB) U10.18(GND) U10.21(SYNC) U10.22(SD)
BOOT: C25.1 U10.11(BOOT)
COMP: C33.2 C34.2 U10.15(COMP)
EA OUT: R63.2 U10.16(EA_OUT)
FB: R61.1 R62.2 U10.13(FB)
GCANH: J10.5 J11.5 ; port GCANH
GCANL: J10.4 J11.4 ; port GCANL
LCANH: J11.7 ; port LCANH
LCANL: J11.6 ; port LCANL
ModuleDisable: R57.2 ; port ModuleDisable
SIA: R58.1 U10.24(SIA)
SOA: R59.1 U10.23(SOA)
SS: C27.1 U10.17(SS)
SW: C25.2 L1.1 U10.5(SW) U10.8(SW)
SW_PRIMARY: R64.2 R65.2 ; port SW_PRIMARY
VDD: C26.1 U10.14(VDD)
NetC33_1: C33.1 R60.2
NetC34_1: C34.1 R63.1
NetD20_1: D20.1(Cathode) D21.2(Anode) R64.1
NetD22_1: D22.1(CATHODE_1) D22.2(CATHODE_2) Q3.3(DRAIN) SW3.5(-)
NetF1_2: F1.2 J9.6
NetF2_2: F2.2 J10.1
NetF3_2: F3.2 J9.4 J10.2
NetF4_2: F4.2 F5.2 J11.1
NetF6_2: F6.2 J11.2
NetQ1_1: Q1.1(GATE) Q2.3(DRAIN) R55.1
NetQ2_1: Q2.1(GATE) R56.1 R57.1 SW2.2
NetQ3_1: Q3.1(GATE) R65.1 R66.2

Not connected (* = marked no-connect by the designer): J9 1* 2* 3*; U10 2(SLEEP_LOGIC) 20(FREQ_ADJ)

### Layout directives
net class HV: +VBATT, NetF1_2

### Notes on the sheet
- From Primary Power
- Bus to outside world.
- Debug Portal
- This should be a 3.3V part
- I'd rather not include this 5V supply on my board, so if Peter gets his 12->5 working then this will not be populated.
- (near D22) This should be a lower voltage part.

### Library data of the parts
C25-C27 C29 C30 C33-C35 = C_0603: CAP CERM 0603; Known Distributors: Digikey; Package: 0603
C28 = C_POLY_680UF_10V: CAP POLY 680UF 10V LOW ESR RAD; Manufacturer: Nichicon; Manufacturer PN: RR71A681MDN1; SVP Creator: Jonathan Nutzmann; ESR: 7.0 mOhm; Package: Radial, Can; Known Distributors: Digikey; ComponentLink1Description: Datasheet; ComponentLink1URL: SVN Datasheet URL; Price: 0.73
C31 C32 = C_0805_1.0uF: CAP CERM 1uF; SVP Creator: Mark Newcomb; Package: 0805; Known Distributors: Digikey; ComponentLink1Description: Datasheet; ComponentLink1URL: http://search.digikey.com/us/en/products/C2012Y5V1H105Z%2F0.85/445-3463-1-ND/1801562
C36 C37 = C_POLY_150UF: CAP POLY 150UF 20V HT 125C RAD; Manufacturer: Nichicon; Manufacturer PN: RHT1D151MDN1; SVP Creator: Jonathan Nutzmann; Tolerance: 20%; ESR: 20.0 mOhm; Package: Radial, Can; Known Distributors: Digikey; ComponentLink1Description: Datasheet; ComponentLink1URL: SVN Datasheet URL; Price: 0.99
D18 = D_SM15TCT: IC TVS ARRAY 2UNI/1BI 15V SOT-23; Manufacturer: Semtech; SVP Creator: Jonathan Nutzmann; Package: SOT-23; Manufacturer PN: SM15.TCT; ComponentLink1Description: Datasheet; ComponentLink1URL: SVN Datasheet URL; Price: .45
D19 = D_MMBZ6V8AL,215: DIODE ESD PROT DBL 4.5V SOT23; Manufacturer: NXP; Manufacturer PN: MMBZ6V8AL,215 - 3.3V VERSION!; SVP Creator: Jonathan Nutzmann; Package: SOT-23; ComponentLink1Description: Datasheet; ComponentLink1URL: SVN Datasheet URL; Price: .45
D20 = D_LED_0805_RED: as D12 on sheet Microcontroller; Package: 0805; Known Distributors: Digikey; Value: RED; ComponentLink1Description: Datasheet
D21 = D_LED_0805_GREEN: as D13 on sheet Microcontroller; Package: 0805; Known Distributors: Digikey; Value: GREEN; HelpURL: http://umnsvp.dyndns.org/svn/centaurus2/datasheets/common parts/LG_R971.pdf; ComponentLink1URL: http://umnsvp.dyndns.org/svn/centaurus2/datasheets/common parts/LG_R971.pdf; ComponentLink1Description: Datasheet
D22 = D_AZ23C36-TP: DIODE ZENER DUAL 36V SOT-23; Manufacturer: Micro; SVP Creator: Jonathan Nutzmann; Package: SOT-23-3; Known Distributors: Digikey; Manufacturer PN: AZ23C36-TP; HelpURL: http://umnsvp.dyndns.org/svn/centaurus2/datasheets/; ComponentLink1URL: http://umnsvp.dyndns.org/svn/centaurus2/datasheets/; ComponentLink1Description: Datasheet
F1-F3 = F_3101.0040: Schurter FPG4 5mm x 20mm Fuse Holder; Dist PN: 486-1159-ND; Distributor: Digikey; Datasheet: http://www.schurterinc.com/var/schurter/storage/ilcatalogue/files/document/datasheet/en/pdf/typ_FPG4.pdf
F4-F6 = F_SSQ 12: FUSE 12A 125V 6125 FAST SSQ; Manufacturer PN: SSQ 12; Manufacturer: Bel Fuse Inc; SVN Creator: Nate Bolyard; Distributor: Digikey; SVN Reviewer 2: *; DataSheet: http://umnsvp.dyndns.org/svn/centaurus2/datasheets/; Price: .606; Package: 2405
J9 = J_PHOENIX_7M_5.08: 7 Pin Male Phoenix Connector 5.08; Manufacturer PN: 1755781; SVP Creator: Jonathan Nutzmann
J10 = J_PHOENIX_5M_3.5: 5 Pin Male Phoenix Connector 3.5; SVP Creator: Jonathan Nutzmann; Manufacturer PN: 1843635
J11 = J_PHOENIX_7M_3.5: 7 Pin Male Phoenix Connector 3.5; SVP Creator: Jonathan Nutzmann; Manufacturer PN: 1843651
L1 = L_33uH_20%: INDUCTOR PWR 33UH 20% SHIELD SMD; Manufacturer: Bourns Inc; Manufacturer PN: SRR1210-330M; Current Rating: 3.7A; SVP Creator: Jonathan Nutzmann; Package: 0.472" L x 0.472" W x 0.394" H (12.00mm x 12.00mm x 10.00mm); Known Distributor: Digikey; ComponentLink1Description: Datasheet
Q1 = Q_AO3401A: MOSFET P-CH -30V -4.3A SOT23; Manufacturer: Alpha & Omega; Distributor: Digikey
Q2 = Q_N_60V_250MA_SOT23: MOSFET N-CH 60V 250MA SOT-23; Manufacturer: Rohm Semiconductor; SVP Creator: Jonathan Nutzmann; Package: SOT-23-3; Known Distributors: Digikey; Manufacturer PN: RK7002BT116; Price: .13@25; ComponentLink1Description: Datasheet
Q3 = Q_2SK3541T2L: MOSFET N-CH 20V 0.9A SOT-23; Manufacturer: Fairchild Semiconductor; Manufacturer PN: FDV305N; SVP Creator: Jonathan Nutzmann; Package: SOT-23-3; Known Distributors: Digikey; Price: 0.46; ComponentLink1Description: Datasheet
R55-R63 R65 R66 = R_0603: Known Distributors: Digikey; Package: 0603
R64 = R_0805_620_1%: as R38 on sheet Microcontroller; Package: 0805; Known Distributor: Digikey; ComponentLink1Description: Datasheet
SW2 = SW_TACT_SWITCH_6x6: as SW1 on sheet Microcontroller; Known Distributors: Digikey; Package: 6mm x 6mm
SW3 = SW_G5LE-1 DC12: RELAY GEN PURPOSE SPDT 10A 12V; Manufacturer: Omron; SVP Creator: Jonathan Nutzmann; Package: Through Hole; Known Distributors: Digikey; Manufacturer PN: G5LE-1 DC12; ComponentLink1Description: Datasheet
U9 = U_MC7805BDTG: IC REG POS VOLT 1A 5V DPAK; Manufacturer: ON Semiconductor; SVP Creator: Jonathan Nutzmann; Known Distributors: Digikey; Manufacturer PN: MC7805BDTG; ComponentLink1Description: Datasheet; ComponentLink1URL: SVN Datasheet URL
U10 = U_LM2650: IC CONVERTER SYNCH DC/DC 24-SOIC; Manufacturer: National Semiconductor; SVP Creator: Jonathan Nutzmann; Package: SOIC-24; Manufacturer PN: LM2650; ComponentLink1Description: Datasheet; ComponentLink1URL: SVN Datasheet URL; Price: 0

## Sheet Contactors.SchDoc
size A
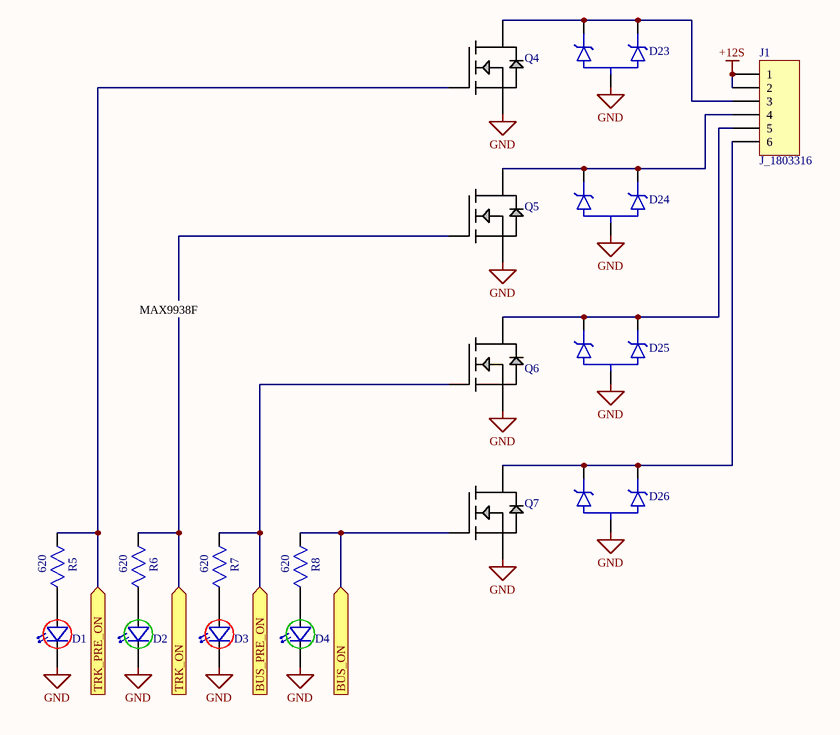
[diagram p4: Contactors.SchDoc]

### Parts
D1  D_LED_0805_RED  [0805P_RED]  (value not drawn)
D2  D_LED_0805_GREEN  [0805P_Green]  (value not drawn)
D3  D_LED_0805_RED  [0805P_RED]  (value not drawn)
D4  D_LED_0805_GREEN  [0805P_Green]  (value not drawn)
D23  D_AZ23C36-TP  [SOT-23]  (value not drawn)
D24  D_AZ23C36-TP  [SOT-23]  (value not drawn)
D25  D_AZ23C36-TP  [SOT-23]  (value not drawn)
D26  D_AZ23C36-TP  [SOT-23]  (value not drawn)
J1  J_1803316  [1844252]
Q4  RK7002BT116  [SOT-23]  (value not drawn)
Q5  RK7002BT116  [SOT-23]  (value not drawn)
Q6  RK7002BT116  [SOT-23]  (value not drawn)
Q7  RK7002BT116  [SOT-23]  (value not drawn)
R5  value 620  [0603_res]  (hidden comment: R_0805_620_1%)
R6  value 620  [0603_res]  (hidden comment: R_0805_620_1%)
R7  value 620  [0603_res]  (hidden comment: R_0805_620_1%)
R8  value 620  [0603_res]  (hidden comment: R_0805_620_1%)

### Ports
BUS_ON, BUS_PRE_ON, TRK_ON, TRK_PRE_ON

### Nets
+12S: J1.1 J1.2
GND: D1.1(Cathode) D2.1(Cathode) D3.1(Cathode) D4.1(Cathode) D23.3(ANODE) D24.3(ANODE) D25.3(ANODE) D26.3(ANODE) Q4.2(SOURCE) Q5.2(SOURCE) Q6.2(SOURCE) Q7.2(SOURCE)
BUS_ON: Q7.1(GATE) R8.2 ; port BUS_ON
BUS_PRE_ON: Q6.1(GATE) R7.2 ; port BUS_PRE_ON
TRK_ON: Q5.1(GATE) R6.2 ; port TRK_ON
TRK_PRE_ON: Q4.1(GATE) R5.2 ; port TRK_PRE_ON
NetD1_2: D1.2(Anode) R5.1
NetD2_2: D2.2(Anode) R6.1
NetD3_2: D3.2(Anode) R7.1
NetD4_2: D4.2(Anode) R8.1
NetD23_1: D23.1(CATHODE_1) D23.2(CATHODE_2) J1.3 Q4.3(DRAIN)
NetD24_1: D24.1(CATHODE_1) D24.2(CATHODE_2) J1.4 Q5.3(DRAIN)
NetD25_1: D25.1(CATHODE_1) D25.2(CATHODE_2) J1.5 Q6.3(DRAIN)
NetD26_1: D26.1(CATHODE_1) D26.2(CATHODE_2) J1.6 Q7.3(DRAIN)

### Notes on the sheet
- MAX9938F

### Library data of the parts
D1 D3 = D_LED_0805_RED: as D12 on sheet Microcontroller; Package: 0805; Known Distributors: Digikey; Value: RED; ComponentLink1Description: Datasheet
D2 D4 = D_LED_0805_GREEN: as D13 on sheet Microcontroller; Package: 0805; Known Distributors: Digikey; Value: GREEN; HelpURL: http://umnsvp.dyndns.org/svn/centaurus2/datasheets/common parts/LG_R971.pdf; ComponentLink1URL: http://umnsvp.dyndns.org/svn/centaurus2/datasheets/common parts/LG_R971.pdf; ComponentLink1Description: Datasheet
D23-D26 = D_AZ23C36-TP: as D22 on sheet Power; Package: SOT-23-3; Known Distributors: Digikey; Manufacturer PN: AZ23C36-TP; HelpURL: http://umnsvp.dyndns.org/svn/centaurus2/datasheets/; ComponentLink1URL: http://umnsvp.dyndns.org/svn/centaurus2/datasheets/; ComponentLink1Description: Datasheet
J1 = J_1803316: CONN HEADER RT ANG 6POS 3.81MM; Manufacturer: Phoenix Contact; Manufacturer PN: 1844252
Q4-Q7 = Q_N_60V_250MA_SOT23: as Q2 on sheet Power; Package: SOT-23-3; Known Distributors: Digikey; Manufacturer PN: RK7002BT116; Price: .13@25; ComponentLink1Description: Datasheet
R5-R8 = R_0805_620_1%: RES 620 OHM 1/8W 1% 0603 SMD; Power Rating: .125W; SVP Creator: Jonathan Nutzmann; Package: 0805; Known Distributor: Digikey; ComponentLink1Description: Datasheet

## Sheet Connectors.SchDoc
size A
Used 6 times, as channels MC1, MC2, MC3, MC4, MC5, MC6. Parts and nets are listed once, with the designators drawn on the sheet.
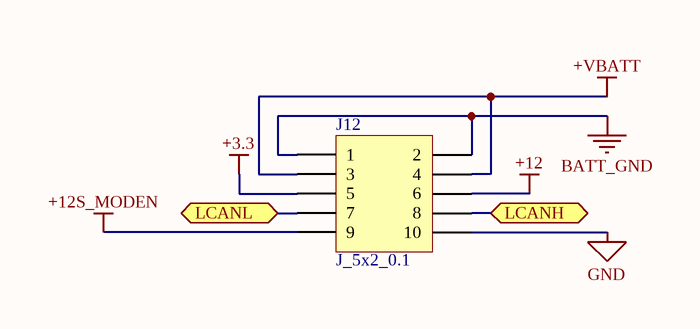
[diagram p5: Connectors.SchDoc]

### Parts
J12  J_5x2_0.1  [10PIN_2_.100IN]

### Ports
LCANH, LCANL

### Nets
+3.3: J12.5
+12: J12.6
+12S_MODEN: J12.9
+VBATT: J12.3 J12.4
BATT_GND: J12.1 J12.2
GND: J12.10
LCANH: J12.8 ; port LCANH
LCANL: J12.7 ; port LCANL

### Channels
MC1: designators end in _1; ports LCANH=LCANH LCANL=LCANL
MC2: designators end in _2; ports LCANH=LCANH LCANL=LCANL
MC3: designators end in _3; ports LCANH=LCANH LCANL=LCANL
MC4: designators end in _4; ports LCANH=LCANH LCANL=LCANL
MC5: designators end in _5; ports LCANH=LCANH LCANL=LCANL
MC6: designators end in _6; ports LCANH=LCANH LCANL=LCANL

### Library data of the parts
J12 = J_5x2_0.1: 5 x 2 0.1" Header

## Nets that join several sheets
+3.3: Microcontroller (25 pins), Fan Control Module (8 pins), CS1 (C4_1.2 D7_1.1 D7_1.2 U1_1.1), CS2 (C4_2.2 D7_2.1 D7_2.2 U1_2.1), Power (11 pins), MC1 (J12_1.5), MC2 (J12_2.5), MC3 (J12_3.5), MC4 (J12_4.5), MC5 (J12_5.5), MC6 (J12_6.5)
+12: CS1 (C11_1.1 U3_1.2), CS2 (C11_2.1 U3_2.2), Power (10 pins), MC1 (J12_1.6), MC2 (J12_2.6), MC3 (J12_3.6), MC4 (J12_4.6), MC5 (J12_5.6), MC6 (J12_6.6)
+12P: Microcontroller (R33.1), Fan Control Module (D10.A D11.A), Power (D18.1 F3.1 SW3.2 SW3.3)
+12S: Power (5 pins), Contactors (J1.1 J1.2)
+12S_MODEN: Power (Q1.3), MC1 (J12_1.9), MC2 (J12_2.9), MC3 (J12_3.9), MC4 (J12_4.9), MC5 (J12_5.9), MC6 (J12_6.9)
+VBATT: Power (F1.1), MC1 (J12_1.3 J12_1.4), MC2 (J12_2.3 J12_2.4), MC3 (J12_3.3 J12_3.4), MC4 (J12_4.3 J12_4.4), MC5 (J12_5.3 J12_5.4), MC6 (J12_6.3 J12_6.4)
BATT_GND: Power (J9.7), MC1 (J12_1.1 J12_1.2), MC2 (J12_2.1 J12_2.2), MC3 (J12_3.1 J12_3.2), MC4 (J12_4.1 J12_4.2), MC5 (J12_5.1 J12_5.2), MC6 (J12_6.1 J12_6.2)
GND: Microcontroller (38 pins), Fan Control Module (X10.1 X11.1), CS1 (6 pins), CS2 (6 pins), Power (34 pins), Contactors (12 pins), MC1 (J12_1.10), MC2 (J12_2.10), MC3 (J12_3.10), MC4 (J12_4.10), MC5 (J12_5.10), MC6 (J12_6.10)
BUS_ON: Microcontroller (U6.33), Contactors (Q7.1 R8.2)
BUS_PRE_ON: Microcontroller (U6.34), Contactors (Q6.1 R7.2)
CSCS1: Microcontroller (R51.1), CS1 (U1_1.5)
CSCS2: Microcontroller (R54.1), CS2 (U1_2.5)
EN1: Microcontroller (U6.42), CS1 (U1_1.7)
EN2: Microcontroller (U6.1), CS2 (U1_2.7)
FAN_PWM1: Microcontroller (U6.58), Fan Control Module (R16.2)
FAN_PWM2: Microcontroller (U6.61), Fan Control Module (R19.2)
FAN_PWM3: Microcontroller (U6.62), Fan Control Module (R22.2)
FAN_PWM4: Microcontroller (U6.63), Fan Control Module (R25.2)
FAN_PWM5: Microcontroller (U6.66), Fan Control Module (R28.2)
FAN_PWM6: Microcontroller (U6.67), Fan Control Module (R29.2)
FAN_PWM7: Microcontroller (U6.68), Fan Control Module (R30.2)
FAN_PWM8: Microcontroller (U6.69), Fan Control Module (R31.2)
FAN_TACH1: Microcontroller (U6.54), Fan Control Module (R17.2 X2.1)
FAN_TACH2: Microcontroller (U6.55), Fan Control Module (R20.2 X3.1)
FAN_TACH3: Microcontroller (U6.56), Fan Control Module (R23.2 X4.1)
FAN_TACH4: Microcontroller (U6.57), Fan Control Module (R26.2 X5.1)
FAN_TACH5: Microcontroller (U6.64), Fan Control Module (R18.2 X6.1)
FAN_TACH6: Microcontroller (U6.65), Fan Control Module (R21.2 X7.1)
FAN_TACH7: Microcontroller (U6.37), Fan Control Module (R24.2 X8.1)
FAN_TACH8: Microcontroller (U6.38), Fan Control Module (R27.2 X9.1)
GCANH: Microcontroller (D16.1 U7.7), Power (J10.5 J11.5)
GCANL: Microcontroller (D16.2 U7.6), Power (J10.4 J11.4)
Iso_GND: Microcontroller (J8.1 J8.4), CS1 (24 pins)
Iso_GND: Microcontroller (J8.7), CS2 (24 pins)
LCANH: Microcontroller (D17.1 U8.7), Power (J11.7), MC1 (J12_1.8), MC2 (J12_2.8), MC3 (J12_3.8), MC4 (J12_4.8), MC5 (J12_5.8), MC6 (J12_6.8)
LCANL: Microcontroller (D17.2 U8.6), Power (J11.6), MC1 (J12_1.7), MC2 (J12_2.7), MC3 (J12_3.7), MC4 (J12_4.7), MC5 (J12_5.7), MC6 (J12_6.7)
ModuleDisable: Microcontroller (U6.4), Power (R57.2)
SCK1: Microcontroller (R50.1), CS1 (U1_1.4)
SCK2: Microcontroller (R53.1 U5.2), CS2 (U1_2.4)
SDI1: Microcontroller (R49.1), CS1 (U1_1.3)
SDI2: Microcontroller (R52.1 U5.3), CS2 (U1_2.3)
SDO1: Microcontroller (U6.16 U6.44), CS1 (R9_1.1)
SDO2: Microcontroller (R36.1 U6.7 U6.17), CS2 (R9_2.1)
SMEASN1: Microcontroller (J8.3), CS1 (F8_1.1)
SMEASN2: Microcontroller (J8.5), CS2 (F8_2.1)
SMEASP1: Microcontroller (J8.2), CS1 (F7_1.1)
SMEASP2: Microcontroller (J8.6), CS2 (F7_2.1)
SW_PRIMARY: Microcontroller (U6.30), Power (R64.2 R65.2)
TRK_ON: Microcontroller (U6.35), Contactors (Q5.1 R6.2)
TRK_PRE_ON: Microcontroller (U6.36), Contactors (Q4.1 R5.2)